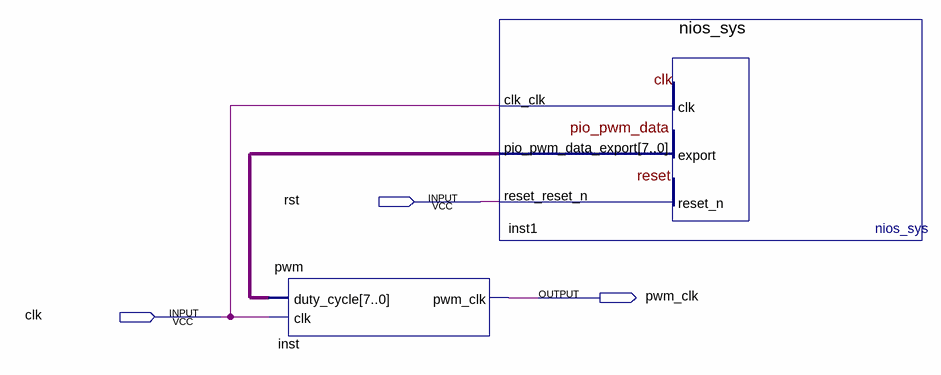
[diagram p0: schematic sheet]
// Quartus schematic motor_controller.bdf as structural Verilog: 2 symbols, 3 pins
module motor_controller (
  input  rst,
  input  clk,
  output pwm_clk
);

  wire [7:0] inst1_pio_pwm_data_export;

  pwm inst (.duty_cycle(inst1_pio_pwm_data_export), .clk(clk), .pwm_clk(pwm_clk));
  nios_sys inst1 (.clk_clk(clk), .reset_reset_n(rst), .pio_pwm_data_export(inst1_pio_pwm_data_export));
endmodule
